# Altium project AdapterXMEGAS.PrjPcb
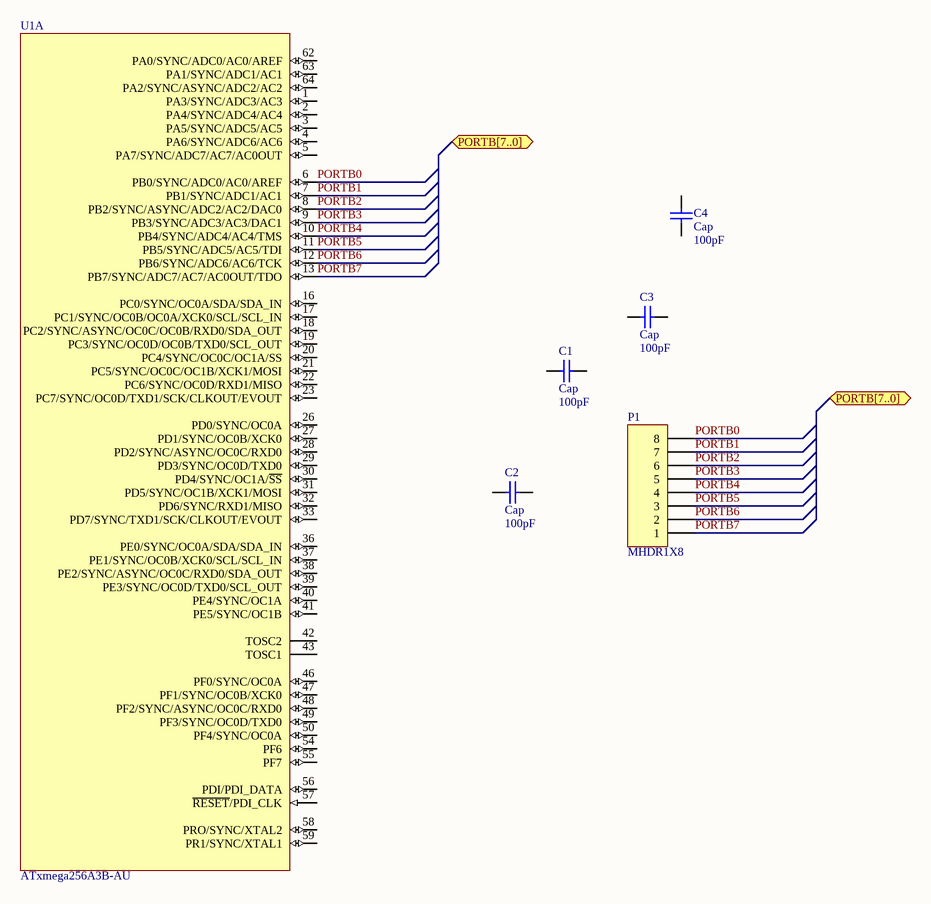
[diagram p0: mainSheet.SchDoc]
1 sheet, 6 parts. Net scope: flat (ports and power ports of the same name join across sheets).
Board file: adapterXmega.PcbDoc

## Sheet mainSheet.SchDoc
size A4

### Parts
C1  Cap  value 100pF  [RAD-0.3]
C2  Cap  value 100pF  [RAD-0.3]
C3  Cap  value 100pF  [RAD-0.3]
C4  Cap  value 100pF  [RAD-0.3]
P1  MHDR1X8  [MHDR1X8]
U1  ATxmega256A3B-AU  [64A_N]  (part A of 2)

### Ports
PORTB[7..0] (bidir)

### Nets
PORTB0: P1.8 U1.6(PB0/SYNC/ADC0/AC0/AREF)
PORTB1: P1.7 U1.7(PB1/SYNC/ADC1/AC1)
PORTB2: P1.6 U1.8(PB2/SYNC/ASYNC/ADC2/AC2/DAC0)
PORTB3: P1.5 U1.9(PB3/SYNC/ADC3/AC3/DAC1)
PORTB4: P1.4 U1.10(PB4/SYNC/ADC4/AC4/TMS)
PORTB5: P1.3 U1.11(PB5/SYNC/ADC5/AC5/TDI)
PORTB6: P1.2 U1.12(PB6/SYNC/ADC6/AC6/TCK)
PORTB7: P1.1 U1.13(PB7/SYNC/ADC7/AC7/AC0OUT/TDO)

Not connected (* = marked no-connect by the designer): C1 1 2; C2 1 2; C3 1 2; C4 1 2; U1 1(PA3/SYNC/ADC3/AC3) 2(PA4/SYNC/ADC4/AC4) 3(PA5/SYNC/ADC5/AC5) 4(PA6/SYNC/ADC6/AC6) 5(PA7/SYNC/ADC7/AC7/AC0OUT) 16(PC0/SYNC/OC0A/SDA/SDA_IN) 17(PC1/SYNC/OC0B/OC0A/XCK0/SCL/SCL_IN) 18(PC2/SYNC/ASYNC/OC0C/OC0B/RXD0/SDA_OUT) 19(PC3/SYNC/OC0D/OC0B/TXD0/SCL_OUT) 20(PC4/SYNC/OC0C/OC1A/SS) 21(PC5/SYNC/OC0C/OC1B/XCK1/MOSI) 22(PC6/SYNC/OC0D/RXD1/MISO) 23(PC7/SYNC/OC0D/TXD1/SCK/CLKOUT/EVOUT) 26(PD0/SYNC/OC0A) 27(PD1/SYNC/OC0B/XCK0) 28(PD2/SYNC/ASYNC/OC0C/RXD0) 29(PD3/SYNC/OC0D/TXD0) 30(PD4/SYNC/OC1A/~{SS}) 31(PD5/SYNC/OC1B/XCK1/MOSI) 32(PD6/SYNC/RXD1/MISO) 33(PD7/SYNC/TXD1/SCK/CLKOUT/EVOUT) 36(PE0/SYNC/OC0A/SDA/SDA_IN) 37(PE1/SYNC/OC0B/XCK0/SCL/SCL_IN) 38(PE2/SYNC/ASYNC/OC0C/RXD0/SDA_OUT) 39(PE3/SYNC/OC0D/TXD0/SCL_OUT) 40(PE4/SYNC/OC1A) 41(PE5/SYNC/OC1B) 42(TOSC2) 43(TOSC1) 46(PF0/SYNC/OC0A) 47(PF1/SYNC/OC0B/XCK0) 48(PF2/SYNC/ASYNC/OC0C/RXD0) 49(PF3/SYNC/OC0D/TXD0) 50(PF4/SYNC/OC0A) 54(PF6) 55(PF7) 56(PDI/PDI_DATA) 57(~{RESET}/PDI_CLK) 58(PRO/SYNC/XTAL2) 59(PR1/SYNC/XTAL1) 62(PA0/SYNC/ADC0/AC0/AREF) 63(PA1/SYNC/ADC1/AC1) 64(PA2/SYNC/ASYNC/ADC2/AC2)

### Library data of the parts
C1-C4 = Cap: Capacitor; Published: 8-Jun-2000; LatestRevisionDate: 17-Jul-2002; LatestRevisionNote: Re-released for DXP Platform.; PackageReference: RAD-0.3; Publisher: Altium Limited; PackageDescription: Radial Cap, Thru-Hole; 2 Leads; 0.3 in Pin Spacing
P1 = MHDR1X8: Header, 8-Pin; LatestRevisionDate: 17-Jul-2002; LatestRevisionNote: Re-released for DXP Platform.; Publisher: Altium Limited
U1 = ATxmega256A3B-AU: 8/16-bit AVR XMEGA A3B Microcontroller, 1.6-3.6V, 256KB + 8KB Flash, 4KB EEPROM, 16KB SRAM, 64-pin TQFP, Industrial Grade (-40°C to 85°C), Pb-Free; Published: 1-Apr-2010; DatasheetVersion: revF, Sep-2009; PackageVersion: revB, Oct-2001; PackageReference: 64A; Publisher: Altium Limited; PackageDescription: 64-Pin Plastic Thin Profile Quad Flat Pack, 14 x 14 x 1.0 mm Body, 0.8 mm Pitch (TQFP); Supplier 1: Digi-Key; Supplier Part Number 1: ATXMEGA256A3B-AU-ND; Supplier 2: Mouser; Supplier Part Number 2: 556-ATXMEGA256A3B-AU; Code_JEDEC: MS-026-AEB; ComponentLink1Description: Manufacturer Link; ComponentLink1URL: http://www.atmel.com/products/avr/default.asp?; ComponentLink2Description: ATxmega256A3B Datasheet; ComponentLink2URL: http://www.atmel.com/dyn/resources/prod_documents/doc8116.pdf; ComponentLink3Description: Atmel.com Home; ComponentLink3URL: http://www.atmel.com